# EAGLE design bitbox_rev2_06.sym (EAGLE 6.5.0)
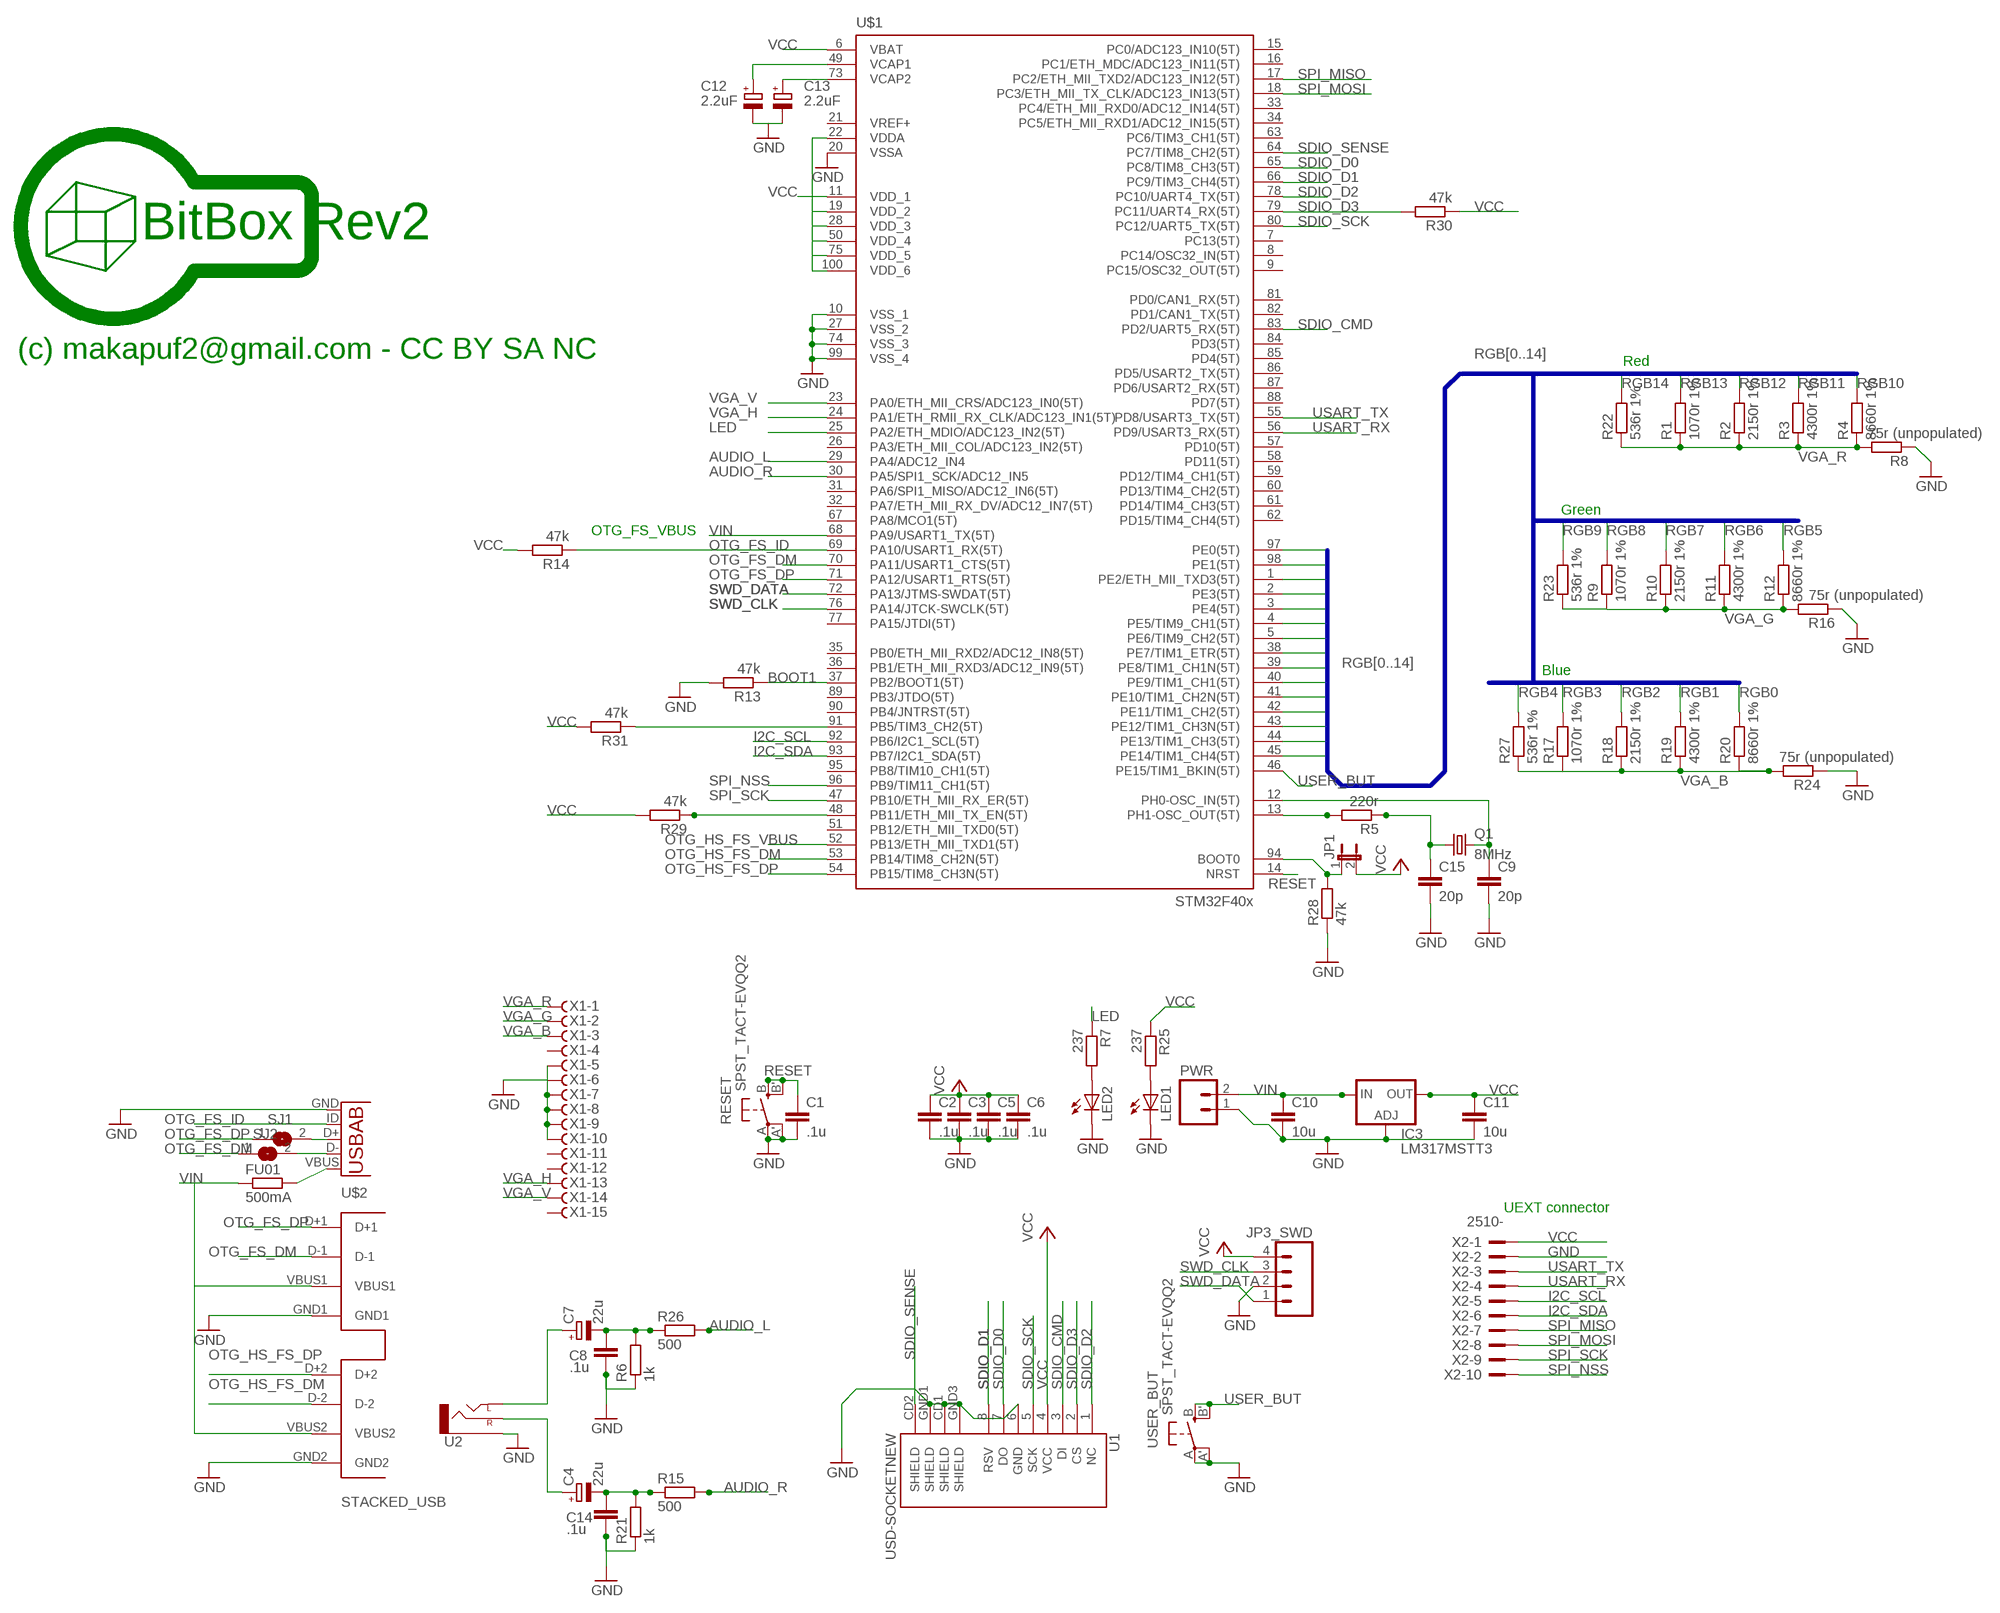
[diagram p0: schematic, sheet 1]

## Parts
C1  .1u  C-EUC0603  [C0603]
C2  .1u  C-EUC0603  [C0603]
C3  .1u  C-EUC0603  [C0603]
C4  22u  CPOL-EU153CLV-0505  [153CLV-0505]
C5  .1u  C-EUC0603  [C0603]
C6  .1u  C-EUC0603  [C0603]
C7  22u  CPOL-EU153CLV-0505  [153CLV-0505]
C8  .1u  C-EUC0603  [C0603]
C9  20p  C-EUC0603  [C0603]
C10  10u  C-EUC1206  [C1206]
C11  10u  C-EUC1206  [C1206]
C12  2.2uF  CPOL-EUSMCB  [SMC_B]
C13  2.2uF  CPOL-EUSMCB  [SMC_B]
C14  .1u  C-EUC0603  [C0603]
C15  20p  C-EUC0603  [C0603]
FU01  500mA  R-EU_R1206  [R1206]
IC3  LM317MSTT3  [SOT223]
JP1  JP1E  [JP1]
JP3_SWD  M04PTH  [1X04]
LED1  LEDCHIPLED_0805  [CHIPLED_0805]
LED2  LEDCHIPLED_0805  [CHIPLED_0805]
PWR  M02PTH  [1X02]
Q1  8MHz  CRYSTALSM49  [SM49]
R1  1070r 1%  R-EU_R0603  [R0603]
R2  2150r 1%  R-EU_R0603  [R0603]
R3  4300r 1%  R-EU_R0603  [R0603]
R4  8660r 1%  R-EU_R0603  [R0603]
R5  220r  R-EU_R0603  [R0603]
R6  1k  R-EU_R0603  [R0603]
R7  237  R-EU_R0603  [R0603]
R8  75r (unpopulated)  R-EU_R0603  [R0603]
R9  1070r 1%  R-EU_R0603  [R0603]
R10  2150r 1%  R-EU_R0603  [R0603]
R11  4300r 1%  R-EU_R0603  [R0603]
R12  8660r 1%  R-EU_R0603  [R0603]
R13  47k  R-EU_R0603  [R0603]
R14  47k  R-EU_R0603  [R0603]
R15  500  R-EU_R0603  [R0603]
R16  75r (unpopulated)  R-EU_R0603  [R0603]
R17  1070r 1%  R-EU_R0603  [R0603]
R18  2150r 1%  R-EU_R0603  [R0603]
R19  4300r 1%  R-EU_R0603  [R0603]
R20  8660r 1%  R-EU_R0603  [R0603]
R21  1k  R-EU_R0603  [R0603]
R22  536r 1%  R-EU_R0603  [R0603]
R23  536r 1%  R-EU_R0603  [R0603]
R24  75r (unpopulated)  R-EU_R0603  [R0603]
R25  237  R-EU_R0603  [R0603]
R26  500  R-EU_R0603  [R0603]
R27  536r 1%  R-EU_R0603  [R0603]
R28  47k  R-EU_R0603  [R0603]
R29  47k  R-EU_R0603  [R0603]
R30  47k  R-EU_R0603  [R0603]
R31  47k  R-EU_R0603  [R0603]
RESET  SPST_TACT-EVQQ2  [EVQ-Q2]
SJ1  SJ  [SJ]
SJ2  SJ  [SJ]
U1  USD-SOCKETNEW  [MICRO-SD-SOCKET-PP]
U2  AUDIO-JACKPTH  [AUDIO-JACK]
U3  USB-AB  [USB-AB-MICRO-SMD]
U$1  STM32F407V  [TQFP100]
U$2  STACKED_USB  [2STACKED]
USER_BUT  SPST_TACT-EVQQ2  [EVQ-Q2]
X1  HF15HS  [HDF15H]
X2  2510-  [PAK100/2500-10]

## Nets
AUDIO_L: R26.2 U$1.29(PA4/ADC12_IN4)
AUDIO_R: R15.2 U$1.30(PA5/SPI1_SCK/ADC12_IN5)
BOOT1: R13.1 U$1.37(PB2/BOOT1(5T))
GND: C1.2 C2.2 C3.2 C5.2 C6.2 C8.2 C9.2 C10.2 C11.2 C12.- C13.- C14.2 C15.2 IC3.1(ADJ) JP3_SWD.2 LED1.C LED2.C PWR.1 R6.1 R8.1 R13.2 R16.1 R21.1 R24.1 R28.1 RESET.A'(P1) RESET.A(P) U1.6(GND) U1.CD1(SHIELD) U1.GND1(SHIELD) U1.GND3(SHIELD) U2.SLEEVE U3.GND U$1.10(VSS_1) U$1.20(VSSA) U$1.27(VSS_2) U$1.74(VSS_3) U$1.99(VSS_4) U$2.GND1 U$2.GND2 USER_BUT.A'(P1) USER_BUT.A(P) X1.5 X1.6 X1.7 X1.8 X1.9 X1.10 X2.2
I2C_SCL: U$1.92(PB6/I2C1_SCL(5T)) X2.5
I2C_SDA: U$1.93(PB7/I2C1_SDA(5T)) X2.6
LED: R7.1 U$1.25(PA2/ETH_MDIO/ADC123_IN2(5T))
N$1: LED2.A R7.2
N$2: C13.+ U$1.73(VCAP2)
N$3: C7.+ U2.TIP(LEFT)
N$4: C12.+ U$1.49(VCAP1)
N$5: SJ1.2 U3.D+
N$6: C15.1 Q1.1 R5.1
N$7: C9.1 Q1.2 U$1.12(PH0-OSC_IN(5T))
N$8: C4.- C14.1 R15.1 R21.2
N$9: C7.- C8.1 R6.2 R26.1
N$10: C4.+ U2.RING(RIGHT)
N$11: FU01.2 U3.VBUS
N$12: SJ2.2 U3.D-
N$15: R31.1 U$1.91(PB5/TIM3_CH2(5T))
N$16: LED1.A R25.2
N$17: R5.2 U$1.13(PH1-OSC_OUT(5T))
N$18: JP1.1 R28.2 U$1.94(BOOT0)
OTG_FS_DM: SJ2.1 U$1.70(PA11/USART1_CTS(5T)) U$2.D-1
OTG_FS_DP: SJ1.1 U$1.71(PA12/USART1_RTS(5T)) U$2.D+1
OTG_FS_ID: R14.1 U3.ID(USBID) U$1.69(PA10/USART1_RX(5T))
OTG_HS_FS_DM: U$1.53(PB14/TIM8_CH2N(5T)) U$2.D-2
OTG_HS_FS_DP: U$1.54(PB15/TIM8_CH3N(5T)) U$2.D+2
OTG_HS_FS_VBUS: U$1.52(PB13/ETH_MII_TXD1(5T))
RESET: C1.1 RESET.B'(S1) RESET.B(S) U$1.14(NRST)
RGB0: R20.2 U$1.97(PE0(5T))
RGB1: R19.2 U$1.98(PE1(5T))
RGB2: R18.2 U$1.1(PE2/ETH_MII_TXD3(5T))
RGB3: R17.2 U$1.2(PE3(5T))
RGB4: R27.2 U$1.3(PE4(5T))
RGB5: R12.2 U$1.4(PE5/TIM9_CH1(5T))
RGB6: R11.2 U$1.5(PE6/TIM9_CH2(5T))
RGB7: R10.2 U$1.38(PE7/TIM1_ETR(5T))
RGB8: R9.2 U$1.39(PE8/TIM1_CH1N(5T))
RGB9: R23.2 U$1.40(PE9/TIM1_CH1(5T))
RGB10: R4.2 U$1.41(PE10/TIM1_CH2N(5T))
RGB11: R3.2 U$1.42(PE11/TIM1_CH2(5T))
RGB12: R2.2 U$1.43(PE12/TIM1_CH3N(5T))
RGB13: R1.2 U$1.44(PE13/TIM1_CH3(5T))
RGB14: R22.2 U$1.45(PE14/TIM1_CH4(5T))
SDIO_CMD: U1.3(DI) U$1.83(PD2/UART5_RX(5T))
SDIO_D0: U1.7(DO) U$1.65(PC8/TIM8_CH3(5T))
SDIO_D1: U1.8(RSV) U$1.66(PC9/TIM3_CH4(5T))
SDIO_D2: U1.1(NC) U$1.78(PC10/UART4_TX(5T))
SDIO_D3: R30.2 U1.2(CS) U$1.79(PC11/UART4_RX(5T))
SDIO_SCK: U1.5(SCK) U$1.80(PC12/UART5_TX(5T))
SDIO_SENSE: U1.CD2(SHIELD) U$1.64(PC7/TIM8_CH2(5T))
SPI_MISO: U$1.17(PC2/ETH_MII_TXD2/ADC123_IN12(5T)) X2.7
SPI_MOSI: U$1.18(PC3/ETH_MII_TX_CLK/ADC123_IN13(5T)) X2.8
SPI_NSS: U$1.96(PB9/TIM11_CH1(5T)) X2.10
SPI_SCK: U$1.47(PB10/ETH_MII_RX_ER(5T)) X2.9
SWD_CLK: JP3_SWD.3 U$1.76(PA14/JTCK-SWCLK(5T))
SWD_DATA: JP3_SWD.1 U$1.72(PA13/JTMS-SWDAT(5T))
USART_RX: U$1.56(PD9/USART3_RX(5T)) X2.4
USART_TX: U$1.55(PD8/USART3_TX(5T)) X2.3
USER_BUT: U$1.46(PE15/TIM1_BKIN(5T)) USER_BUT.B'(S1) USER_BUT.B(S)
VCC: C2.1 C3.1 C5.1 C6.1 C11.1 IC3.4(OUT) JP1.2 JP3_SWD.4 R14.2 R25.1 R29.2 R30.1 R31.2 U1.4(VCC) U$1.6(VBAT) U$1.11(VDD_1) U$1.19(VDD_2) U$1.22(VDDA) U$1.28(VDD_3) U$1.50(VDD_4) U$1.75(VDD_5) U$1.100(VDD_6) X2.1
VGA_B: R17.1 R18.1 R19.1 R20.1 R24.2 R27.1 X1.3
VGA_G: R9.1 R10.1 R11.1 R12.1 R16.2 R23.1 X1.2
VGA_H: U$1.24(PA1/ETH_RMII_RX_CLK/ADC123_IN1(5T)) X1.13
VGA_R: R1.1 R2.1 R3.1 R4.1 R8.2 R22.1 X1.1
VGA_V: U$1.23(PA0/ETH_MII_CRS/ADC123_IN0(5T)) X1.14
VIN: C10.1 FU01.1 IC3.3(IN) PWR.2 U$1.68(PA9/USART1_TX(5T)) U$2.VBUS1 U$2.VBUS2
YYY: R29.1 U$1.48(PB11/ETH_MII_TX_EN(5T))
Unconnected: U$1.7(PC13(5T)) U$1.8(PC14/OSC32_IN(5T)) U$1.9(PC15/OSC32_OUT(5T)) U$1.15(PC0/ADC123_IN10(5T)) U$1.16(PC1/ETH_MDC/ADC123_IN11(5T)) U$1.21(VREF+) U$1.26(PA3/ETH_MII_COL/ADC123_IN2(5T)) U$1.31(PA6/SPI1_MISO/ADC12_IN6(5T)) U$1.32(PA7/ETH_MII_RX_DV/ADC12_IN7(5T)) U$1.33(PC4/ETH_MII_RXD0/ADC12_IN14(5T)) U$1.34(PC5/ETH_MII_RXD1/ADC12_IN15(5T)) U$1.35(PB0/ETH_MII_RXD2/ADC12_IN8(5T)) U$1.36(PB1/ETH_MII_RXD3/ADC12_IN9(5T)) U$1.51(PB12/ETH_MII_TXD0(5T)) U$1.57(PD10(5T)) U$1.58(PD11(5T)) U$1.59(PD12/TIM4_CH1(5T)) U$1.60(PD13/TIM4_CH2(5T)) U$1.61(PD14/TIM4_CH3(5T)) U$1.62(PD15/TIM4_CH4(5T)) U$1.63(PC6/TIM3_CH1(5T)) U$1.67(PA8/MCO1(5T)) U$1.77(PA15/JTDI(5T)) U$1.81(PD0/CAN1_RX(5T)) U$1.82(PD1/CAN1_TX(5T)) U$1.84(PD3(5T)) U$1.85(PD4(5T)) U$1.86(PD5/USART2_TX(5T)) U$1.87(PD6/USART2_RX(5T)) U$1.88(PD7(5T)) U$1.89(PB3/JTDO(5T)) U$1.90(PB4/JNTRST(5T)) U$1.95(PB8/TIM10_CH1(5T)) X1.4 X1.11 X1.12 X1.15

## Buses
RGB[0..14]

## Notes on the sheet
- BitBox Rev2
- (c) makapuf2@gmail.com - CC BY SA NC
- Red
- Green
- OTG_FS_VBUS
- Blue
- UEXT connector

## Library data of the parts
C1-C3 C5 C6 C8-C11 C14 C15 = resistor:C-EU: CAPACITOR, European symbol
C4 C7 C12 C13 = resistor:CPOL-EU: POLARIZED CAPACITOR, European symbol
FU01 R1-R31 = resistor:R-EU_: RESISTOR, European symbol
IC3 = v-reg:LM317?*: 500 mA Adjustable Output Positive Voltage Regulator Source: http://www.onsemi.co.jp .. LM317M-D.PDF
JP1 = jumper:JP1E: JUMPER
JP3_SWD = SparkFun-Connectors:M04: Header 4 Standard 4-pin 0.1" header. Use with straight break away headers (SKU : PRT-00116), right angle break away headers (PRT-00553), swiss pins (PRT-00743), machine pins (PRT-00117), and female headers (PRT-00115). Molex polarized connector foot print use with SKU : PRT-08231 with associated crimp pins and housings. 1MM SMD Version SKU: PRT-10208
LED1 LED2 = led:LED: LED OSRAM: - CHIPLED LG R971, LG N971, LY N971, LG Q971, LY Q971, LO R971, LY R971 LH N974, LH R974 LS Q976, LO Q976, LY Q976 LO Q996 - Hyper CHIPLED LW Q18S LB Q993, LB Q99A, LB R99A - SideLED LS A670, LO A670, LY A670, LG A670, LP A670 LB A673, LV A673, LT A673, LW A673 LH A674 LY A675 LS A676, LA A676, LO A676, LY A676, LW A676 LS A679, LY A679, LG A679 - Hyper Micro SIDELED® LS Y876, LA Y876, LO Y876, LY Y876 LT Y87S - SmartLED LW L88C, LW L88S LB L89C, LB L89S, LG L890 LS L89K, LO L89K, LY L89K LS L896, LA L896, LO L896, LY L896 - TOPLED LS T670, LO T670, LY T670, LG T670, LP T670 LSG T670, LSP T670, LSY T670, LOP T670, LYG T670 LG T671, LOG T671, LSG T671 LB T673, LV T673, LT T673, LW T673 LH T674 LS T676, LA T676, LO T676, LY T676, LB T676, LH T676, LSB T676, LW T676 LB T67C, LV T67C, LT T67C, LS T67K, LO T67K, LY T67K, LW E67C LS E67B, LA E67B, LO E67B, LY E67B, LB E67C, LV E67C, LT E67C LW T67C LS T679, LY T679, LG T679 LS T770, LO T770, LY T770, LG T770, LP T770 LB T773, LV T773, LT T773, LW T773 LH T774 LS E675, LA E675, LY E675, LS T675 LS T776, LA T776, LO T776, LY T776, LB T776 LHGB T686 LT T68C, LB T68C - Hyper Mini TOPLED® LB M676 - Mini TOPLED Santana® LG M470 LS M47K, LO M47K, LY M47K Source: http://www.osram.convergy.de LUXEON: - LUMILED® LXK2-PW12-R00, LXK2-PW12-S00, LXK2-PW14-U00, LXK2-PW14-V00 LXK2-PM12-R00, LXK2-PM12-S00, LXK2-PM14-U00 LXK2-PE12-Q00, LXK2-PE12-R00, LXK2-PE12-S00, LXK2-PE14-T00, LXK2-PE14-U00 LXK2-PB12-K00, LXK2-PB12-L00, LXK2-PB12-M00, LXK2-PB14-N00, LXK2-PB14-P00, LXK2-PB14-Q00 LXK2-PR12-L00, LXK2-PR12-M00, LXK2-PR14-Q00, LXK2-PR14-R00 LXK2-PD12-Q00, LXK2-PD12-R00, LXK2-PD12-S00 LXK2-PH12-R00, LXK2-PH12-S00 LXK2-PL12-P00, LXK2-PL12-Q00, LXK2-PL12-R00 Source: www.luxeon.com KINGBRIGHT: KA-3528ASYC Source: www.kingbright.com
PWR = SparkFun-Connectors:M02: Header 2 Standard 2-pin 0.1" header. Use with straight break away headers (SKU : PRT-00116), right angle break away headers (PRT-00553), swiss pins (PRT-00743), machine pins (PRT-00117), and female headers (PRT-00115). Molex polarized connector foot print use with SKU : PRT-08233 with associated crimp pins and housings.
Q1 = crystal:CRYSTAL: CRYSTAL; OC_FARNELL: unknown; OC_NEWARK: unknown
RESET USER_BUT = adafruit:SPST_TACT: SMT 6mm switch, EVQQ2 series http://www.ladyada.net/library/eagle
SJ1 SJ2 = jumper:SJ: SMD solder JUMPER
U1 = SparkFun-Connectors:USD-SOCKET: microSD Socket Push-push type uSD socket. Schematic element and footprint production proven. Spark Fun Electronics SKU : PRT-00127. tDoc lines correctly indicate media card edge positions when inserting (unlocked, locked, depressed).
U2 = SparkFun-Connectors:AUDIO-JACK: 3.5mm Audio Jack Simple 3.5mm common PCB mount audio jack. SKU: PRT-08032
U3 = SparkFun-Connectors:USB-AB: This is a USB AB connector that is compatible with USB OTG. i.e. this connector can serve as a host or device
U$1 = stm32f4:STM32F407V: STM32F407 100 pin LQFP reviewed: YES tested: YES
U$2 = my_conn:STACKED_USB
X1 = con-subd:HF15?S: SUB-D; OC_FARNELL: unknown; OC_NEWARK: unknown
X2 = con-3m:2510-: 3M (TM) Pak 100 4-Wall Header Source: 3M; MF: 3M; MPN: 2510-6002UB; OC_FARNELL: 9838244; OC_NEWARK: 46F4725

## Board
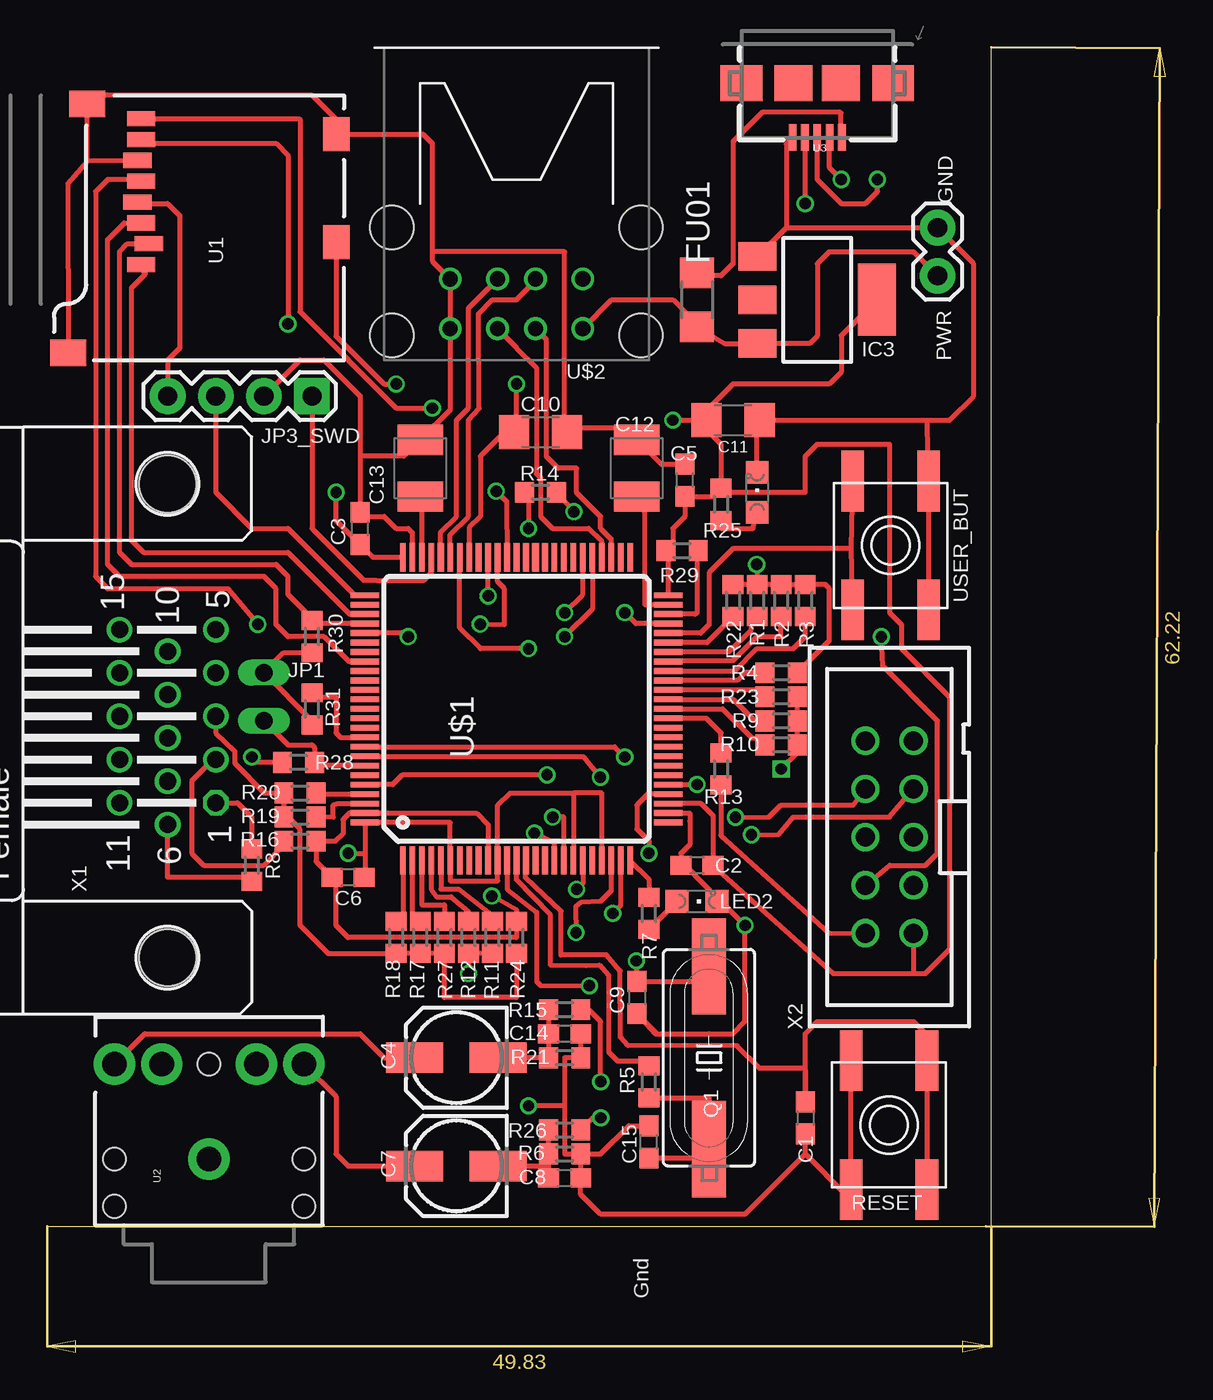
[diagram p1: board, top side]
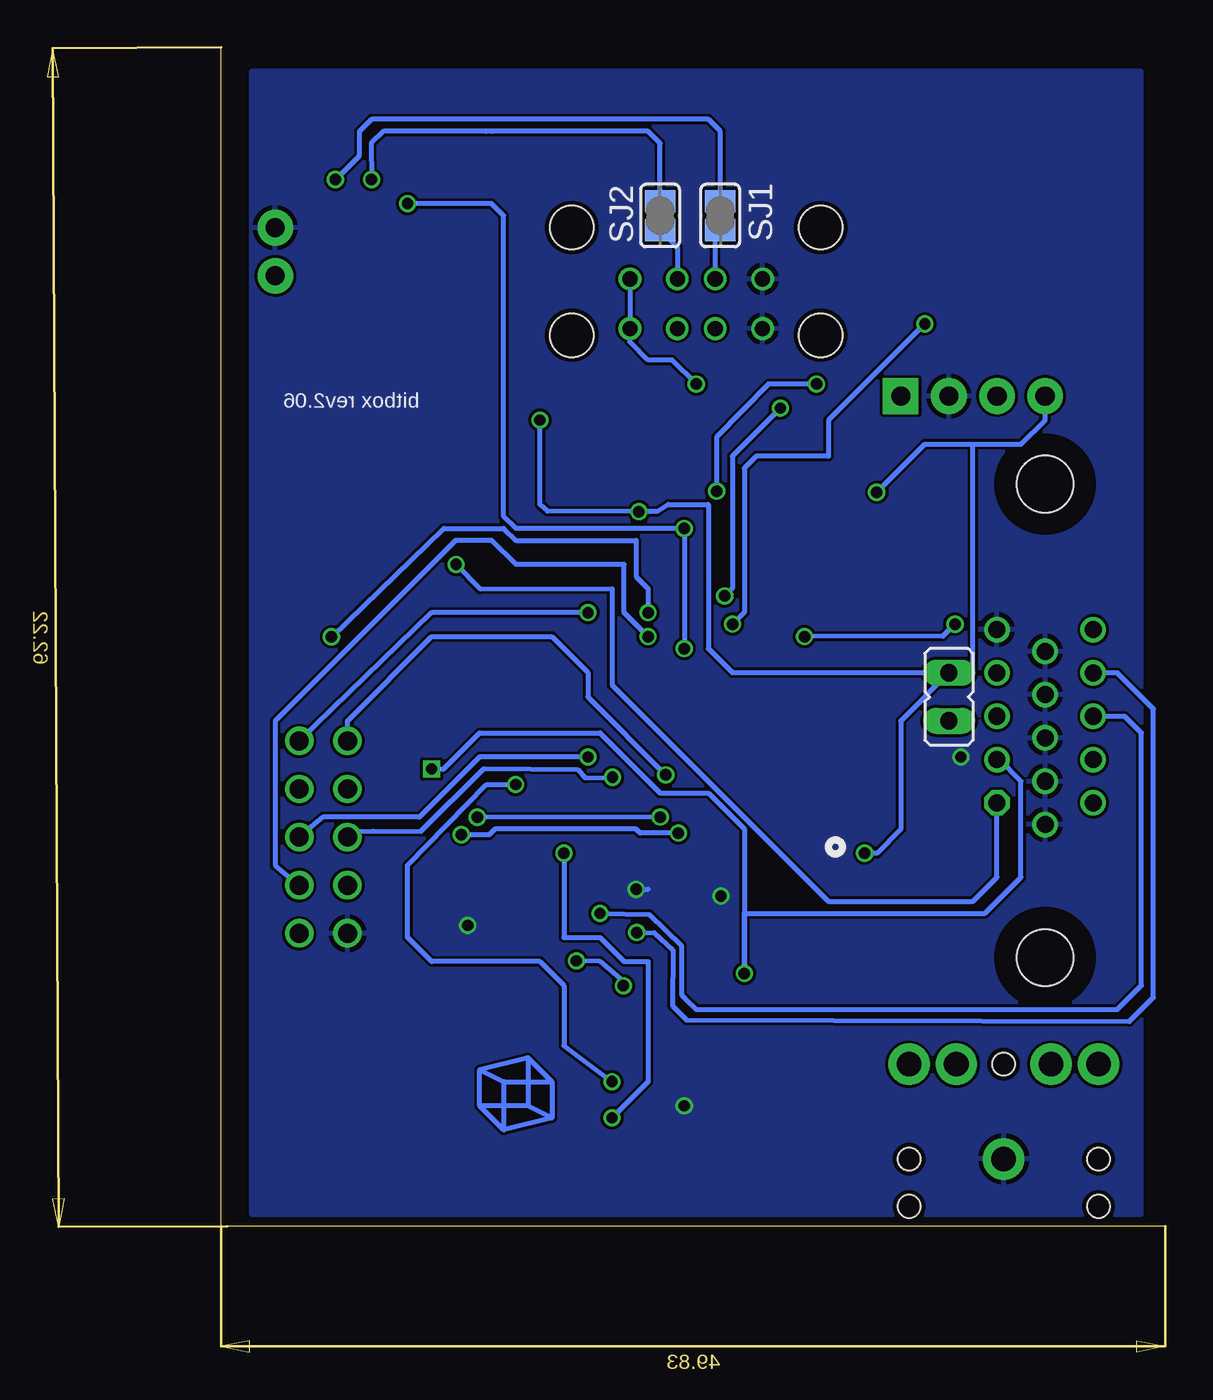
[diagram p2: board, bottom side, seen from below]

Size 49.83 x 62.22 mm. Coordinates in mm from the lower left corner, seen from the top.
Outline: 0,0 49.83,0 49.83,62.22
Copper layers (1*2*15*16): Top 0.035mm / dielectric 0.2mm / layer 2 0.0175mm / dielectric 1.1mm / layer 15 0.0175mm / dielectric 0.2mm / Bottom 0.035mm
Design rules "SeeedStudio_DRU_no_angle_20130527": minimum track width 6mil, minimum drill 12mil, track to track 6mil, track to pad 6mil, pad to pad 6mil, via to via 6mil, smd to smd 0mil, copper to edge 10mil, drill to drill 10mil, minimum pad ring 6mil, minimum via ring 6mil, stop-mask expansion 2mil, vias tented up to drill 25mil, thermal gap 10mil

### Footprints (pad centres in the part's own frame; a part is rotated, then mirrored left to right if it is on the bottom)
C0603 = smd 1.1 x 1: 1 -0.85,0; 2 0.85,0
153CLV-0505 = smd 3 x 1.6: + 2.2,0; - -2.2,0
C1206 = smd 1.6 x 1.8: 1 -1.4,0; 2 1.4,0
SMC_B = smd 1.6 x 2.4: + -1.5,0; - 1.5,0
R1206 = smd 1.6 x 1.803: 1 -1.422,0; 2 1.422,0
SOT223 = smd 1.5 x 2: 1 -2.3,-3.15; 2 0,-3.15; 3 2.3,-3.15 | smd 3.8 x 2: 4 0,3.15
JP1 = drill 0.914 long: 1 0,-1.27; 2 0,1.27
1X04 = drill 1.016 pad 1.88 square: 1 0,0 | drill 1.016 pad 1.88: 2 2.54,0; 3 5.08,0; 4 7.62,0
CHIPLED_0805 = smd 1.2 x 1.2: A 0,-1.05; C 0,1.05
1X02 = drill 1.016 pad 1.88: 1 0,0; 2 2.54,0
SM49 = smd 5.08 x 1.778: 1 -4.826,0; 2 4.826,0
R0603 = smd 1 x 1.1: 1 -0.85,0; 2 0.85,0
EVQ-Q2 = smd 3.2 x 1.2: A -3.4,-2; A' 3.4,-2; B -3.4,2; B' 3.4,2
SJ = smd 1.168 x 1.6: 1 -0.762,0; 2 0.762,0
MICRO-SD-SOCKET-PP = smd 0.8 x 1.5: 1 -8.94,10.7; 2 -7.84,10.3; 3 -6.74,10.7; 4 -5.64,10.9; 5 -4.54,10.7; 6 -3.44,10.9; 7 -2.34,10.7; 8 -1.24,10.7 | smd 1.8 x 1.4: CD1 -2.05,0.4; CD2 -7.75,0.4 | smd 1.4 x 1.9: GND1 -13.6,14.55; GND3 -0.45,13.55
AUDIO-JACK = drill 1.3 pad 2.184: RING 5,5; RSH 5,2.5; SLEEVE 0,0; TIP 5,-5; TSH 5,-2.5 | hole 1.2: 0,5; -2.5,5; -2.5,-5; 0,-5; 5,0
USB-AB-MICRO-SMD = smd 1.4 x 0.4: D+ 2.85,0; D- 2.85,0.65; GND 2.85,-1.3; ID 2.85,-0.65; VBUS 2.85,1.3 | smd 1.9 x 2: P$6 0,1.25; P$7 0,-1.25 | smd 1.9 x 2.2: P$8 0,4; P$9 0,-4
TQFP100 = smd 1.5 x 0.3: 1 -8,6; 2 -8,5.5; 3 -8,5; 4 -8,4.5; 5 -8,4; 6 -8,3.5; 7 -8,3; 8 -8,2.5; 9 -8,2; 10 -8,1.5; 11 -8,1; 12 -8,0.5; 13 -8,0; 14 -8,-0.5; 15 -8,-1; 16 -8,-1.5; 17 -8,-2; 18 -8,-2.5; 19 -8,-3; 20 -8,-3.5; 21 -8,-4; 22 -8,-4.5; 23 -8,-5; 24 -8,-5.5; 25 -8,-6; 51 8,-6; 52 8,-5.5; 53 8,-5; 54 8,-4.5; 55 8,-4; 56 8,-3.5; 57 8,-3; 58 8,-2.5; 59 8,-2; 60 8,-1.5; 62 8,-0.5; 63 8,0; 64 8,0.5; 65 8,1; 66 8,1.5; 67 8,2; 68 8,2.5; 69 8,3; 70 8,3.5; 72 8,4.5; 73 8,5; 74 8,5.5; 75 8,6 | smd 0.3 x 1.5: 26 -6,-8; 27 -5.5,-8; 28 -5,-8; 29 -4.5,-8; 30 -4,-8; 31 -3.5,-8; 32 -3,-8; 33 -2.5,-8; 34 -2,-8; 35 -1.5,-8; 36 -1,-8; 37 -0.5,-8; 38 0,-8; 39 0.5,-8; 40 1,-8; 41 1.5,-8; 42 2,-8; 43 2.5,-8; 44 3,-8; 45 3.5,-8; 46 4,-8; 47 4.5,-8; 48 5,-8; 49 5.5,-8; 50 6,-8; 76 6,8; 77 5.5,8; 78 5,8; 79 4.5,8; 80 4,8; 81 3.5,8; 82 3,8; 83 2.5,8; 84 2,8; 85 1.5,8; 86 1,8; 87 0.5,8; 88 0,8; 89 -0.5,8; 90 -1,8; 91 -1.5,8; 92 -2,8; 93 -2.5,8; 94 -3,8; 95 -3.5,8; 96 -4,8; 97 -4.5,8; 98 -5,8; 99 -5.5,8; 100 -6,8 | smd 1.5 x 0.35: 61 8,-1; 71 8,4
2STACKED = drill 0.8: D+1 1,2.71; D+2 1,5.33; D-1 -1,2.71; D-2 -1,5.33; GND1 3.5,2.71; GND2 3.5,5.33; VBUS1 -3.5,2.71; VBUS2 -3.5,5.33 | hole 2.3: -6.57,0; -6.57,5.68; 6.57,5.68; 6.57,0
HDF15H = drill 0.9 octagon: 1 4.329,2.54 | drill 0.9: 2 2.043,2.54; 3 -0.243,2.54; 4 -2.529,2.54; 5 -4.815,2.54; 6 5.472,0; 7 3.186,0; 8 0.9,0; 9 -1.386,0; 10 -3.672,0; 11 4.329,-2.54; 12 2.043,-2.54; 13 -0.243,-2.54; 14 -2.529,-2.54; 15 -4.815,-2.54 | hole 3: -12.5,0; 12.5,0
PAK100/2500-10 = drill 1 pad 1.422: 1 -5.08,-1.27; 2 -5.08,1.27; 3 -2.54,-1.27; 4 -2.54,1.27; 5 0,-1.27; 6 0,1.27; 7 2.54,-1.27; 8 2.54,1.27; 9 5.08,-1.27; 10 5.08,1.27

### Placement (x,y rotation side)
C1  40.01,5.71 270 top
C2  34.29,19.05 180 top
C3  16.51,36.83 90 top
C4  21.59,8.89 180 top
C5  33.66,39.37 90 top
C6  15.88,18.41 180 top
C7  21.59,3.18 180 top
C8  27.3,2.54 0 top
C9  31.12,12.06 270 top
C10  26.03,41.91 0 top
C11  36.2,42.55 0 top
C12  31.12,40.01 90 top
C13  19.69,40.01 90 top
C14  27.3,10.16 0 top
C15  31.75,4.45 90 top
FU01  34.29,48.9 90 top
IC3  40.64,48.9 270 top
JP1  11.43,27.94 0 bottom
JP3_SWD  13.97,43.82 180 top
LED1  37.47,38.73 0 top
LED2  34.29,17.15 270 top
PWR  46.99,52.7 270 top
Q1  34.92,8.89 90 top
R1  37.47,33.02 270 top
R2  38.73,33.02 270 top
R3  40.01,33.02 270 top
R4  38.73,29.21 180 top
R5  31.75,7.62 90 top
R6  27.3,3.81 180 top
R7  31.75,16.51 270 top
R8  10.8,19.05 90 top
R9  38.73,26.67 180 top
R10  38.73,25.4 180 top
R11  23.49,15.24 90 top
R12  22.23,15.24 90 top
R13  35.56,24.13 270 top
R14  26.03,38.73 0 top
R15  27.3,11.43 0 top
R16  13.34,20.32 180 top
R17  19.69,15.24 90 top
R18  18.41,15.24 90 top
R19  13.34,21.59 0 top
R20  13.34,22.86 0 top
R21  27.3,8.89 180 top
R22  36.2,33.02 270 top
R23  38.73,27.94 180 top
R24  24.77,15.24 270 top
R25  35.56,38.1 270 top
R26  27.3,5.08 0 top
R27  20.95,15.24 90 top
R28  13.26,24.48 0 top
R29  33.51,35.66 180 top
R30  13.97,31.12 90 top
R31  13.97,27.3 270 top
RESET  44.42,5.34 270 top
SJ1  23.49,53.34 90 bottom
SJ2  26.67,53.34 90 bottom
U1  15.65,59.69 90 top
U2  8.53,3.55 90 top
U3  40.64,60.33 270 top
U$1  24.77,27.3 90 top
U$2  24.77,52.7 180 top
USER_BUT  44.51,35.93 90 top
X1  6.35,26.67 270 top
X2  44.45,20.54 90 top

### Tracks (layer width: path | path; a pad name or v marks a point on that pad's centre or on a via)
AUDIO_L  (via drill 0.6)
  Top 0.254: U$1.29 31.7,22.8 31.12,22.23 31.12,20.95 31.75,20.32 v31.75,19.69 | v29.21,5.71 28.79,5.71 R26.2
  Bottom 0.254: v31.75,19.69 31.75,15.24 29.84,15.24 28.58,13.97 27.3,13.97 27.3,7.62 v29.21,5.71
AUDIO_R  (via drill 0.6)
  Top 0.254: U$1.30 34.29,23.3 v34.3,23.32 | v29.21,7.62 29.21,10.79 28.58,11.43 R15.2
  Bottom 0.254: v29.21,7.62 31.75,9.53 31.75,12.7 33.02,13.97 38.73,13.97 40.01,15.24 40.01,19.05 35.83,23.3 v34.3,23.32
BOOT1
  Top 0.254: R13.1 35.56,26.03 34.79,26.8 U$1.37
GND  (via drill 0.6)
  Top 0.254: 2.11,56.22 U1.GND3 2.77,59.69 13.97,59.69 15.48,58.19 U1.CD1 19.83,57.64 20.32,57.15 20.32,51.44 | U1.6 2.11,56.22 | 20.32,51.44 20.32,50.94 U$2.GND1 U$2.GND2 21.27,43.09 C13.- 18.82,40.64 16.51,40.64 | USER_BUT.A USER_BUT.A' 46.45,42.45 46.35,42.55 | C5.2 32.4,40.22 C12.- 29.84,42.14 27.66,42.14 C10.2 27.3,42.04 27.3,51.44 20.32,51.44 | U$1.10 23.27,21.19 22.65,21.8 U$1.99 15.95,21.8 15.6,21.46 15.6,20.71 15.21,20.32 R16.1 14.18,19.26 C6.2 | 2.11,56.22 1.08,55.04 U1.GND1 | C3.2 16.73,37.47 17.78,37.47 18.41,36.83 19.05,36.83 19.27,36.62 U$1.74 | JP3_SWD.2 13.34,45.72 14.61,45.72 16.51,43.82 16.51,40.64 | 16.51,40.64 C3.2 | LED1.C 37.47,42.41 C11.2 46.35,42.55 | C3.2 16.51,37.47 | IC3.1 39,52.7 | 39,52.7 PWR.1 48.89,50.8 48.89,43.82 47.62,42.55 46.35,42.55 | U3.GND 39,57.14 39,52.7 | U$1.27 33.92,21.8 33.92,21.39 33.91,21.39 33.91,20.15 33.44,19.69 C2.2 33.44,19.27 34.92,17.78 34.92,17.56 LED2.C 35.56,17.15 v36.83,15.87 36.83,10.79 36.2,10.16 34.92,10.16 32.08,10.16 C9.2 32.17,10.16 | RESET.A RESET.A' 42.13,1.68 40.01,3.81 | 31.97,5.29 C15.2 30.7,5.29 29.21,3.81 R6.1 | R6.1 C8.2 28.16,1.69 29.21,0.63 36.83,0.63 40.01,3.81 | 27.3,6.35 27.3,8.89 R21.1 C14.2 | 27.3,6.35 27.3,3.81 R6.1 | R8.1 10.58,18.41 6.35,18.41 X1.6 | R28.1 11.08,24.48 v10.8,24.77 | U$1.20 28.27,18.1 v27.94,17.78 | X2.2 41.25,15.47 35.56,20.63 35.56,22.54 35.56,22.86 R13.2 | C6.2 14.61,18.41 | v23.46,17.42 24.77,16.7 R24.1 24.77,15.24 15.88,15.24 15.24,15.87 15.24,18.41 C6.2 | 40.01,3.81 C1.2 | 27.3,6.35 v25.4,6.35
  Bottom 0.254: v27.94,17.78 27.3,17.78 | v23.46,17.42 23.56,17.39 23.49,17.46
  pour Bottom: 1.27,60.96 48.26,60.96 48.26,60.33 48.26,0.63 1.27,0.63
I2C_SCL  (via drill 0.6)
  Top 0.254: U$1.92 29.94,25.3 v30.48,24.77
  Bottom 0.254: v30.48,24.77 36.2,24.77 39.37,21.59 44.45,21.59 X2.5
I2C_SDA  (via drill 0.6)
  Top 0.254: v29.19,23.69 28.34,24.76 27.3,24.77 16.8,24.77 U$1.93
  Bottom 0.254: X2.6 42.74,20.84 41.82,20.85 39.31,20.84 35.97,24.15 31.02,24.1 30.77,23.82 30.61,23.66 v29.19,23.69
LED
  Top 0.254: U$1.25 31.75,18.32 R7.1
N$1
  Top 0.254: R7.2 LED2.A
N$2
  Top 0.254: C13.+ 19.77,38.43 U$1.73
N$3
  Top 0.254: U2.TIP 15.24,6.84 15.24,3.81 15.88,3.18 C7.+
N$4
  Top 0.254: C12.+ 31.53,37.66 31.53,32.81 31.97,32.8 U$1.49
N$5  (via drill 0.6)
  Top 0.254: U3.D+ 40.64,55.25 41.91,53.98 43.18,53.98 43.81,54.61 v43.81,55.25
  Bottom 0.254: SJ1.2 23.49,57.79 24.13,58.42 41.91,58.42 42.55,57.79 42.55,56.52 v43.81,55.25
N$6
  Top 0.254: R5.1 34.92,6.77 Q1.1 34.92,3.6 C15.1
N$7  (via drill 0.6)
  Top 0.254: U$1.12 24.27,17.77 25.82,16.56 25.82,12.91 26.03,12.7 v28.61,12.69 | Q1.2 34.76,12.92 C9.1 v31.09,14
  Bottom 0.254: v28.61,12.69 28.4,12.74 29.84,13.97 v31.09,14
N$8
  Top 0.254: R15.1 C14.1 R21.2 C4.-
N$9
  Top 0.254: C7.- 26.45,3.18 | 26.45,3.18 R6.2 R26.1 | 26.45,3.18 C8.1
N$10
  Top 0.254: U2.RING 5.15,10.16 16.51,10.16 17.78,8.89 C4.+
N$11
  Top 0.254: U3.VBUS 41.89,57.52 41.89,58.75 41.86,58.79 37.73,58.79 36.2,57.25 36.2,50.8 35.56,50.16 34.71,50.16 FU01.2
N$12  (via drill 0.6)
  Top 0.254: v41.91,55.25 41.29,55.87 U3.D-
  Bottom 0.254: SJ2.2 26.67,57.15 27.3,57.79 35.56,57.79 35.85,57.78 41.27,57.78 41.92,57.16 v41.91,55.25
N$13
  Bottom 0.254: 32.38,7.62 32.38,5.71 | 32.38,5.71 34.92,5.08 | 34.92,7.62 32.38,7.62 | 32.38,7.62 33.66,8.89 | 33.66,8.89 36.2,8.26 | 36.2,8.26 34.92,7.62 | 34.92,7.62 34.92,5.08 | 34.92,5.08 36.2,6.35 | 36.2,6.35 36.2,8.26 | 33.66,8.89 33.66,6.35 | 33.66,6.35 32.38,5.71 | 33.66,6.35 36.2,6.35
N$15
  Top 0.254: R31.1 14.18,27.94 15.24,27.94 15.24,26.03 15.47,25.8 U$1.91
N$16
  Top 0.254: R25.2 35.56,36.83 37.24,36.83 LED1.A
N$17
  Top 0.254: U$1.13 24.75,18.29 26.54,16.45 26.54,13.79 28.45,13.76 29.15,13.79 29.63,13.25 29.63,9.2 30.09,8.71 31.51,8.71 R5.2
N$18
  Top 0.254: JP1.1 12.7,25.4 13.97,25.4 14.11,25.26 R28.2 arc90 14.28,24.3 U$1.94
OTG_FS_DM
  Top 0.254: U$1.70 21.27,36.51 22.23,37.47 22.23,42.55 22.8,43.16 22.76,48.15 23.49,48.9 24.77,48.9 25.77,49.9 U$2.D-1
  Bottom 0.254: SJ2.1 25.77,51.67 U$2.D-1
OTG_FS_DP
  Top 0.254: U$1.71 20.77,36.64 21.59,37.47 21.59,42.55 22.23,43.18 22.23,48.45 U$2.D+1
  Bottom 0.254: SJ1.1 23.77,52.31 U$2.D+1
OTG_FS_ID  (via drill 0.6)
  Top 0.254: R14.1 25.4,38.52 v25.4,36.83 | v25.4,30.48 22.86,30.48 21.77,31.58 U$1.69 | U3.ID 39.99,53.98 v40.01,53.98
  Bottom 0.254: v25.4,30.48 v25.4,36.83 34.29,36.83 34.92,37.47 34.92,53.34 35.56,53.98 v40.01,53.98
OTG_HS_FS_DM
  Top 0.254: U$1.53 29.77,36.27 29.21,36.83 29.21,37.47 28.58,38.1 27.94,38.71 27.94,40.01 26.96,40.01 26.34,40.62 26.34,46.8 U$2.D-2
OTG_HS_FS_DP
  Top 0.254: U$1.54 29.27,36.14 28.58,36.83 26.67,36.83 26.03,37.47 26.03,39.5 25.82,39.72 25.82,45.3 24.77,46.36 24.77,46.38 U$2.D+2
RESET
  Top 0.254: RESET.B' RESET.B 46.45,10.06 45.72,10.79 40.64,10.79 40.01,10.16 C1.1 40.01,8.26 39.91,8.35 37.59,8.35 36.41,9.53 30.66,9.53 30.25,9.98 30.23,13.48 29.51,14.33 27.13,14.32 27.11,14.31 27.12,16.62 25.24,18.38 U$1.14
RGB0
  Top 0.254: R20.2 14.13,22.8 U$1.97
RGB1
  Top 0.254: U$1.98 15.32,22.3 15.09,22.22 15.09,21.59 R19.2
RGB2
  Top 0.254: U$1.1 18.77,16.44 R18.2
RGB3
  Top 0.254: U$1.2 19.27,16.51 R17.2
RGB4
  Top 0.254: U$1.3 19.77,16.96 20.95,16.96 R27.2
RGB5
  Top 0.254: U$1.4 20.27,17.78 20.53,17.38 21.32,17.38 22.23,16.61 R12.2 22.23,16.51
RGB6
  Top 0.254: U$1.5 20.78,17.8 21.7,17.8 23.49,16.39 R11.2
RGB7
  Top 0.254: U$1.38 35.65,27.3 37.19,25.76 37.52,25.76 R10.2
RGB8
  Top 0.254: U$1.39 36.21,27.8 37.3,26.71 37.84,26.71 R9.2
RGB9
  Top 0.254: R23.2 37.88,28.3 U$1.40
RGB10
  Top 0.254: R4.2 36.83,29.21 36.42,28.8 U$1.41
RGB11
  Top 0.254: U$1.42 36.29,29.3 37.47,30.48 39.37,30.48 40.01,31.12 R3.2
RGB12
  Top 0.254: U$1.43 32.8,29.84 36.2,29.84 37.47,31.12 38.73,31.12 R2.2
RGB13
  Top 0.254: U$1.44 35.96,30.3 37.16,31.51 37.16,31.86 R1.2
RGB14
  Top 0.254: R22.2 34.83,30.8 U$1.45
SDIO_CMD
  Top 0.254: U1.3 4.05,52.95 3.18,52.07 3.18,34.93 3.81,34.29 11.43,34.29 12.07,33.66 12.07,31.75 12.7,31.12 14.61,31.12 15.91,29.8 U$1.83
SDIO_D0  (via drill 0.6)
  Top 0.254: U1.7 5.38,57.15 12.07,57.15 12.7,56.52 v12.7,47.62 | v22.85,31.77 24.13,31.75 24.13,33.66 23.77,34.02 U$1.65
  Bottom 0.254: v12.7,47.62 17.78,42.55 17.78,40.64 21.59,40.64 22.23,40.01 22.23,32.39 v22.85,31.77
SDIO_D1  (via drill 0.6)
  Top 0.254: U1.8 13.3,58.45 13.34,58.42 13.34,48.26 18.41,43.18 v20.32,43.18 | v23.27,33.26 v23.27,33.25 U$1.66
  Bottom 0.254: v20.32,43.18 22.86,40.64 22.86,33.66 v23.27,33.26
SDIO_D2
  Top 0.254: 5.08,50.66 U1.1 5.18,50.26 4.45,49.53 4.45,36.2 5.08,35.56 12.7,35.56 15.95,32.3 U$1.78
SDIO_D3
  Top 0.254: U$1.79 14.24,31.8 | 14.24,31.8 arc90 R30.2 | 14.24,31.8 12.7,33.34 12.7,34.29 12.07,34.93 4.45,34.93 3.81,35.56 3.81,51.44 4.23,51.85 U1.2
SDIO_SCK  (via drill 0.6)
  Top 0.254: v19.05,31.12 18.86,31.3 U$1.80 | U1.5 5.08,55.25 3.18,55.25 2.54,54.61 2.54,34.29 3.18,33.66 9.52,33.66 v11.11,31.77
  Bottom 0.254: v19.05,31.12 11.74,31.14 v11.11,31.77
SDIO_SENSE  (via drill 0.6)
  Top 0.254: U1.CD2 15.24,46.98 17.78,44.45 v18.41,44.45 | v23.69,38.79 24.25,38.25 U$1.64
  Bottom 0.254: v18.41,44.45 20.95,44.45 23.69,41.64 v23.69,38.79
SPI_MISO  (via drill 0.6)
  Top 0.254: U$1.17 26.77,20.23 v25.71,20.75 | v37.17,20.66 38.6,20.68 39.37,21.59 44.45,21.59 X2.7
  Bottom 0.254: v37.17,20.66 35.7,20.65 35.39,20.96 27.94,20.95 27.73,20.75 v25.71,20.75
SPI_MOSI  (via drill 0.6)
  Top 0.254: U$1.18 27.27,21.59 v26.67,21.59 | v36.32,21.59 38.1,21.59 38.73,22.23 42.55,22.23 X2.8
  Bottom 0.254: v26.67,21.59 v36.32,21.59
SPI_NSS  (via drill 0.6)
  Top 0.254: v26.38,23.82 18.73,23.81 18.23,23.3 U$1.96
  Bottom 0.254: X2.10 43.18,26.67 38.73,31.12 32.38,31.12 30.48,29.21 30.48,27.94 v26.38,23.82
SPI_SCK  (via drill 0.6)
  Top 0.254: U$1.47 31.06,31.8 v30.48,32.39
  Bottom 0.254: v30.48,32.39 38.73,32.39 X2.9
SWD_CLK
  Top 0.254: JP3_SWD.3 8.89,38.73 10.8,36.83 12.7,36.83 16.23,33.3 U$1.76
SWD_DATA
  Top 0.254: U$1.72 20.27,34.47 19.88,34.08 17.35,34.08 17.33,34.09 16.69,34.09 15.56,35.24 13.97,36.83 JP3_SWD.1
USART_RX  (via drill 0.6)
  Top 0.254: X2.4 44.45,19.05 46.35,19.05 46.99,19.69 46.99,26.67 44.1,29.56 v44.03,31.11 | v27.3,32.39 28.27,33.34 U$1.56
  Bottom 0.254: v44.03,31.11 38.1,36.83 34.92,36.83 34.29,36.2 27.94,36.2 27.94,34.29 27.3,33.66 v27.3,32.39
USART_TX  (via drill 0.6)
  Top 0.254: U$1.55 28.77,32.58 v27.3,31.12
  Bottom 0.254: v27.3,31.12 28.58,32.39 28.58,34.93 34.29,34.93 35.56,36.2 37.47,36.2 46.99,26.67 46.99,19.05 X2.3
USER_BUT
  Top 0.254: USER_BUT.B 42.44,35.76 | 42.44,35.76 USER_BUT.B' | 42.44,35.76 36.18,35.76 34.92,34.49 34.92,31.75 34.48,31.3 U$1.46
VCC  (via drill 0.6)
  Top 0.254: U1.4 5.05,53.98 6.35,53.98 6.98,53.34 6.98,46.36 6.35,45.72 JP3_SWD.4 | 16.77,19.69 U$1.100 21.27,21.3 U$1.6 21.27,18.23 23.77,18.23 U$1.11 23.77,22.23 24.41,22.86 24.77,22.86 27.77,22.86 | 16.77,19.69 16.77,18.41 C6.1 | U$1.50 32.77,35.52 R29.2 33.02,35.77 33.02,36.83 33.66,37.47 C5.1 35.13,38.52 R25.1 | 18.73,35.34 U$1.75 17.19,35.3 C3.1 15.24,37.25 v15.24,38.73 | IC3.4 41.91,47.02 41.91,45.09 41.27,44.45 36.2,44.45 34.8,43.05 C11.1 | C11.1 34.8,42.04 35.56,41.27 R25.1 | 27.77,22.86 U$1.19 | U$1.22 29.27,22.86 27.77,22.86 | U$1.28 34.51,22.3 35.14,21.67 C2.1 41.49,13.33 45.72,13.33 | 45.72,13.33 46.35,13.33 47.62,14.6 47.62,27.94 45.09,30.48 45.09,31.75 44.45,32.39 44.45,41.27 40.64,41.27 40.01,40.64 40.01,38.73 35.56,38.73 R25.1 | R30.1 12.48,30.27 JP1.2 13.97,26.67 R31.2 | v15.88,19.69 16.77,19.69 | v33.02,42.55 C11.1 | v27.79,37.71 26.94,38.64 R14.2 | X2.1 45.72,13.33
  Bottom 0.254: v15.24,38.73 12.7,41.27 10.16,41.27 | 10.16,41.27 7.62,41.27 6.35,42.55 JP3_SWD.4 | 10.16,41.27 10.16,29.21 JP1.2 | JP1.2 13.97,26.67 13.97,20.95 15.24,19.69 v15.88,19.69 | v33.02,42.55 33.02,38.1 32.62,37.73 v27.79,37.71 26.85,37.72 26.25,38.1 24.13,38.1 24.13,30.48 22.86,29.21 JP1.2
VGA_B
  Top 0.254: R24.2 24.77,12.06 20.95,12.06 R27.1 R17.1 R18.1 14.82,14.39 13.34,15.87 13.34,20.95 12.7,21.59 R19.1 R20.1 11.43,22.86 9.9,24.44 9.9,25.08 8.89,26.03 X1.3
VGA_G  (via drill 0.6)
  Top 0.254: R11.1 R12.1 v22.23,13.33 | X1.2 8.75,24.63 7.62,23.49 7.62,19.69 8.25,19.05 11.43,19.05 12.48,20.1 R16.2 | R23.1 R9.1 R10.1 39.59,24.98 v38.73,24.13
  Bottom 0.254: X1.2 8.75,24.63 7.62,23.49 7.62,18.41 9.52,16.51 22.23,16.51 v22.23,13.33 22.23,20.95 24.13,22.86 26.67,22.86 29.84,26.03 36.2,26.03 38.1,24.13 v38.73,24.13
VGA_H  (via drill 0.6)
  Top 0.254: U$1.24 30.27,16.93 v29.84,16.51
  Bottom 0.254: X1.13 2.15,26.91 1.27,26.03 1.27,12.7 2.53,11.44 24.77,11.43 25.36,12.02 25.54,12.22 25.55,14.82 27.24,16.45 v29.84,16.51
VGA_R  (via drill 0.6)
  Top 0.254: R1.1 R2.1 R3.1 41.06,33.87 41.27,33.66 41.27,30.9 R4.1 | R1.1 R22.1 36.26,33.94 | X1.1 10.04,22.34 10.8,21.59 R8.2 | v37.45,34.93 37.47,34.91 R1.1
  Bottom 0.254: v37.45,34.93 36.17,33.64 29.21,33.66 29.21,28.58 17.78,17.15 10.16,17.15 8.89,18.41 X1.1
VGA_V  (via drill 0.6)
  Top 0.254: U$1.23 29.77,17.7 29.21,17.15 28.16,17.08 27.89,16.86 v27.91,15.5
  Bottom 0.254: v27.91,15.5 26.97,15.48 26.01,14.57 26.01,11.63 25.28,10.88 1.91,10.79 0.64,12.06 0.64,27.3 2.53,29.2 X1.14
VIN  (via drill 0.6)
  Top 0.254: U$1.68 22.27,36.87 22.86,37.47 22.86,40.64 24.13,41.91 C10.1 24.77,42.04 v24.77,44.45 | U$2.VBUS2 29.78,48.9 33.02,48.9 33.87,48.05 FU01.1 35.74,46.59 IC3.3 40.24,46.59 40.64,46.99 40.64,50.8 41.27,51.44 45.72,51.44 PWR.2
  Bottom 0.254: U$2.VBUS1 U$2.VBUS2 28.27,46.68 27.3,45.72 26.03,45.72 v24.77,44.45
YYY
  Top 0.254: R29.1 34.29,35.34 34.29,32.39 34.21,32.3 U$1.48

### Text on the board
tNames: GND | Gnd
_bsilk: bitbox rev2.06